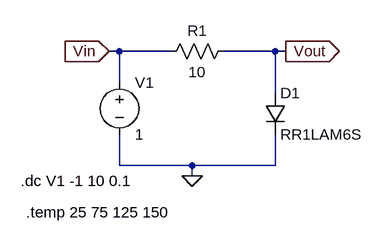
[diagram p0: schematic Draft14.asc]
Draft14.asc, the LTspice schematic file:
Version 4
SHEET 1 880 680
WIRE 16 64 0 64
WIRE 96 64 16 64
WIRE 256 64 176 64
WIRE 272 64 256 64
WIRE 16 112 16 64
WIRE 256 128 256 64
WIRE 16 240 16 192
WIRE 128 240 16 240
WIRE 256 240 256 192
WIRE 256 240 128 240
WIRE 128 256 128 240
FLAG 128 256 0
FLAG 272 64 Vout
IOPIN 272 64 Out
FLAG 0 64 Vin
IOPIN 0 64 In
SYMBOL diode 240 128 R0
SYMATTR InstName D1
SYMATTR Value RR1LAM6S
SYMBOL res 192 48 R90
WINDOW 0 0 56 VBottom 2
WINDOW 3 32 56 VTop 2
SYMATTR InstName R1
SYMATTR Value 10
SYMBOL voltage 16 96 R0
WINDOW 123 0 0 Left 0
WINDOW 39 0 0 Left 0
SYMATTR InstName V1
SYMATTR Value 1
TEXT -136 264 Left 2 !.dc V1 -1 10 0.1
TEXT -128 312 Left 2 !.temp 25 75 125 150

The netlist it stands for:
* Draft14.asc
D1 Vout 0 RR1LAM6S
R1 Vout Vin 10
V1 Vin 0 1
.model D D
.lib standard.dio
.dc V1 -1 10 0.1
.temp 25 75 125 150
.backanno
.end

* Results of the author's LTspice run, read from the files saved beside the schematic
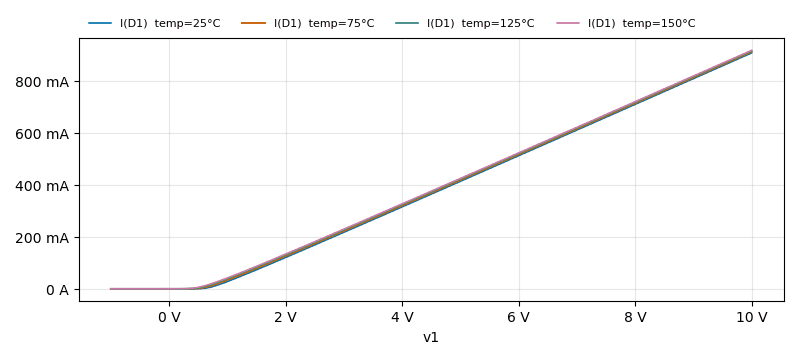
[diagram p1: DC transfer characteristic of Draft14.asc, plotted from the saved traces]
* DC transfer characteristic, 4 runs:
*   I(D1) [temp=25°C]: -6.978 nA at v1=-1 V, 907.7 mA at v1=10 V, min -6.978 nA, max 907.7 mA
*   I(D1) [temp=75°C]: -195.6 nA at v1=-1 V, 911.4 mA at v1=10 V, min -195.6 nA, max 911.4 mA
*   I(D1) [temp=125°C]: -2.476 µA at v1=-1 V, 915.3 mA at v1=10 V, min -2.476 µA, max 915.3 mA
*   I(D1) [temp=150°C]: -7.131 µA at v1=-1 V, 917.3 mA at v1=10 V, min -7.131 µA, max 917.3 mA